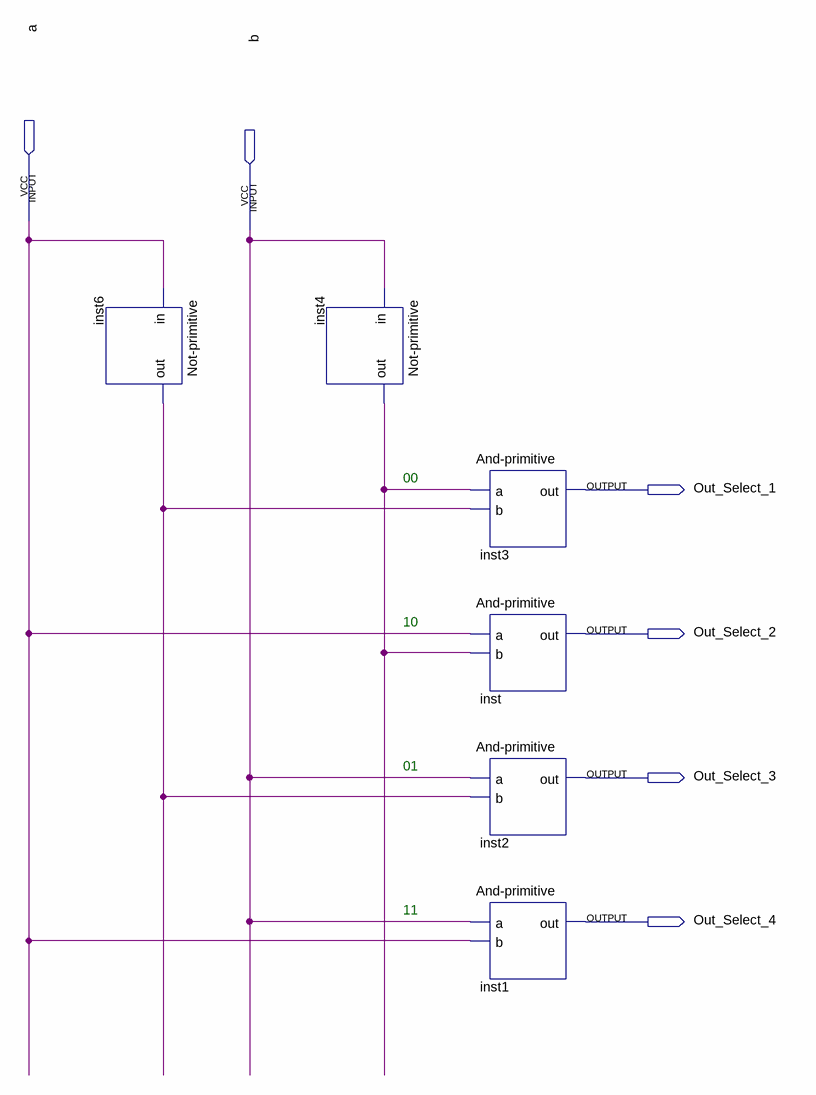
[diagram p0: schematic sheet]
// Quartus schematic 2To4Decoder.bdf as structural Verilog: 6 symbols, 6 pins
module \2To4Decoder  (
  input  a,
  input  b,
  output Out_Select_1,
  output Out_Select_2,
  output Out_Select_3,
  output Out_Select_4
);

  wire inst4_out, inst6_out;

  \Not-primitive  inst6 (.in(a), .out(inst6_out));
  \Not-primitive  inst4 (.in(b), .out(inst4_out));
  \And-primitive  inst3 (.a(inst4_out), .b(inst6_out), .out(Out_Select_1));
  \And-primitive  inst (.a(a), .b(inst4_out), .out(Out_Select_2));
  \And-primitive  inst2 (.a(b), .b(inst6_out), .out(Out_Select_3));
  \And-primitive  inst1 (.a(b), .b(a), .out(Out_Select_4));

  // Notes on the sheet:
  //   00
  //   10
  //   01
  //   11
endmodule
